# Altium schematic sheet Part J.SchDoc
size A4; SheetNumber: 5; SheetTotal: 16
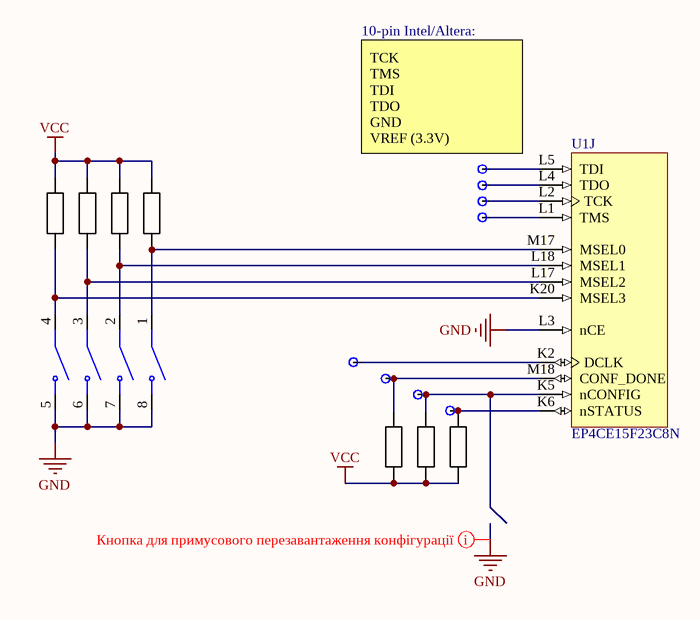
[diagram p0: Part J.SchDoc]

## Parts
J199  Pin1  [Pin1]  (value not drawn)
J200  Pin1  [Pin1]  (value not drawn)
J201  Pin1  [Pin1]  (value not drawn)
J202  Pin1  [Pin1]  (value not drawn)
J203  Pin1  [Pin1]  (value not drawn)
J204  Pin1  [Pin1]  (value not drawn)
J205  Pin1  [Pin1]  (value not drawn)
J206  Pin1  [Pin1]  (value not drawn)
R8  10kOm 0603  [RES 0603]  (value not drawn)
R9  10kOm 0603  [RES 0603]  (value not drawn)
R10  10kOm 0603  [RES 0603]  (value not drawn)
R11  10kOm 0603  [RES 0603]  (value not drawn)
R12  10kOm 0603  [RES 0603]  (value not drawn)
R13  10kOm 0603  [RES 0603]  (value not drawn)
R14  10kOm 0603  [RES 0603]  (value not drawn)
S2  206-4  [SW_206-4]  (value not drawn)
U1  EP4CE15F23C8N  [FBGA484_A-240]  (part J of 13)

## Nets
GND: S2.5(NO4) S2.6(NO3) S2.7(NO2) S2.8(NO1) U1.L3(nCE)
VCC: R8.2 R9.2 R10.2 R11.2 R12.1 R13.1 R14.1
NetJ199_1: J199.1 U1.L5(TDI)
NetJ200_1: J200.1 U1.L4(TDO)
NetJ201_1: J201.1 U1.L2(TCK)
NetJ202_1: J202.1 U1.L1(TMS)
NetJ203_1: J203.1 U1.K2(DCLK)
NetJ204_1: J204.1 R12.2 U1.M18(CONF_DONE)
NetJ205_1: J205.1 R13.2 U1.K5(nCONFIG)
NetJ206_1: J206.1 R14.2 U1.K6(nSTATUS)
NetR8_1: R8.1 S2.4(COM4) U1.K20(MSEL3)
NetR9_1: R9.1 S2.3(COM3) U1.L17(MSEL2)
NetR10_1: R10.1 S2.2(COM2) U1.L18(MSEL1)
NetR11_1: R11.1 S2.1(COM1) U1.M17(MSEL0)

## Layout directives
mark named Кнопка для примусового перезавантаження конфігурації: GND

## Notes on the sheet
- 10-pin Intel/Altera:
- (near J199) TCK
  TMS
  TDI
  TDO
  GND
  VREF (3.3V)

## Library data of the parts
S2 = 206-4: MF: {'manufacturer': u'CTS Components'}; Package: None; Price: None; Value: *; MP: 206-4; Availability: Unavailable
U1 = FPGA_EP4CE15F23C8N: Cyclone IV Family FPGA, 1.2V Core, 343 I/O Pins, 4 PLLs, 484-Pin FBGA, Speed Grade 8, Commercial Grade, Pb-Free; Manufacturer: Altera; PackageVersion: ver1.0, Jun-2011; PackageReference: FBGA484_A-240; ComponentLink3URL: http://www.altera.com/literature/lit-dp.jsp?category=cyc%204&showspreadsheet=y; ComponentLink1Description: Manufacturer URL; DatasheetVersion: ver1.6, Nov-2011; ComponentLink3Description: Pinout; ComponentLink2URL: http://www.altera.com/literature/hb/cyclone-iv/cyclone4-handbook.pdf; ComponentLink1URL: http://www.altera.com/; ComponentLink2Description: Handbook; PackageDescription: 484-Pin FineLine Ball Grid Array (FBGA) - Wire Bond - A:2.40; Code_JEDEC: MS-034-AAJ-1; ComponentLink4URL: http://www.altera.com/devicepackaging/04R00247-02.pdf; ComponentLink4Description: Package Specification